# Altium schematic sheet S8050_C83271_S8050_C8327.schdoc
size 127 x 101 mm
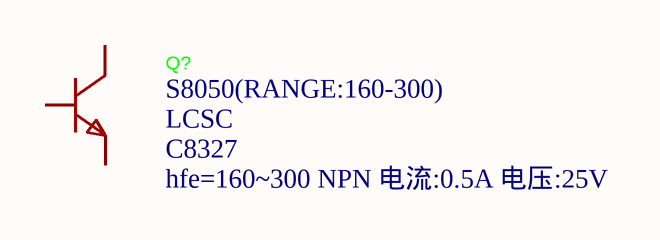
[diagram p0: S8050_C83271_S8050_C8327.schdoc]

## Parts
Q?  LCSC Part Name: hfe=160~300 NPN 电流:0.5A 电压:25V  Supplier Part: C8327  Supplier: LCSC  [TO-92-3_L4.9-W3.7-P1.27-L]  (hidden comment: S8050(RANGE:160-300))

## Nets

Not connected (* = marked no-connect by the designer): Q? 1(E) 2(B) 3(C)

## Library data of the parts
Q? = S8050(RANGE:160-300): Manufacturer: CJ(江苏长电/长晶); Symbol: S8050_C8327; Add into BOM: yes; type: NPN; Current - Collector(Ic): 500mA; Collector - Emitter Voltage VCEO: 25V; Pd - Power Dissipation: 625mW; DC Current Gain: 160@500mA,1V; Transition frequency(fT): 150MHz; Current - Collector Cutoff: 100nA; Vce Saturation(VCE(sat)): 600mV; Emitter-Base Voltage(Vebo): 5V; Device: S8050(RANGE:160-300); Manufacturer Part: S8050(RANGE:160-300); Supplier Footprint: TO-92; JLCPCB Part Class: Extended Part; Datasheet: https://item.szlcsc.com/datasheet/S8050(RANGE%253A160-300)/8819.html; Convert to PCB: yes; Operating Temperature: -55℃~+150℃